# Altium schematic sheet 2040Macro-PCB.SchDoc
size A; SheetNumber: 3; SheetTotal: 9
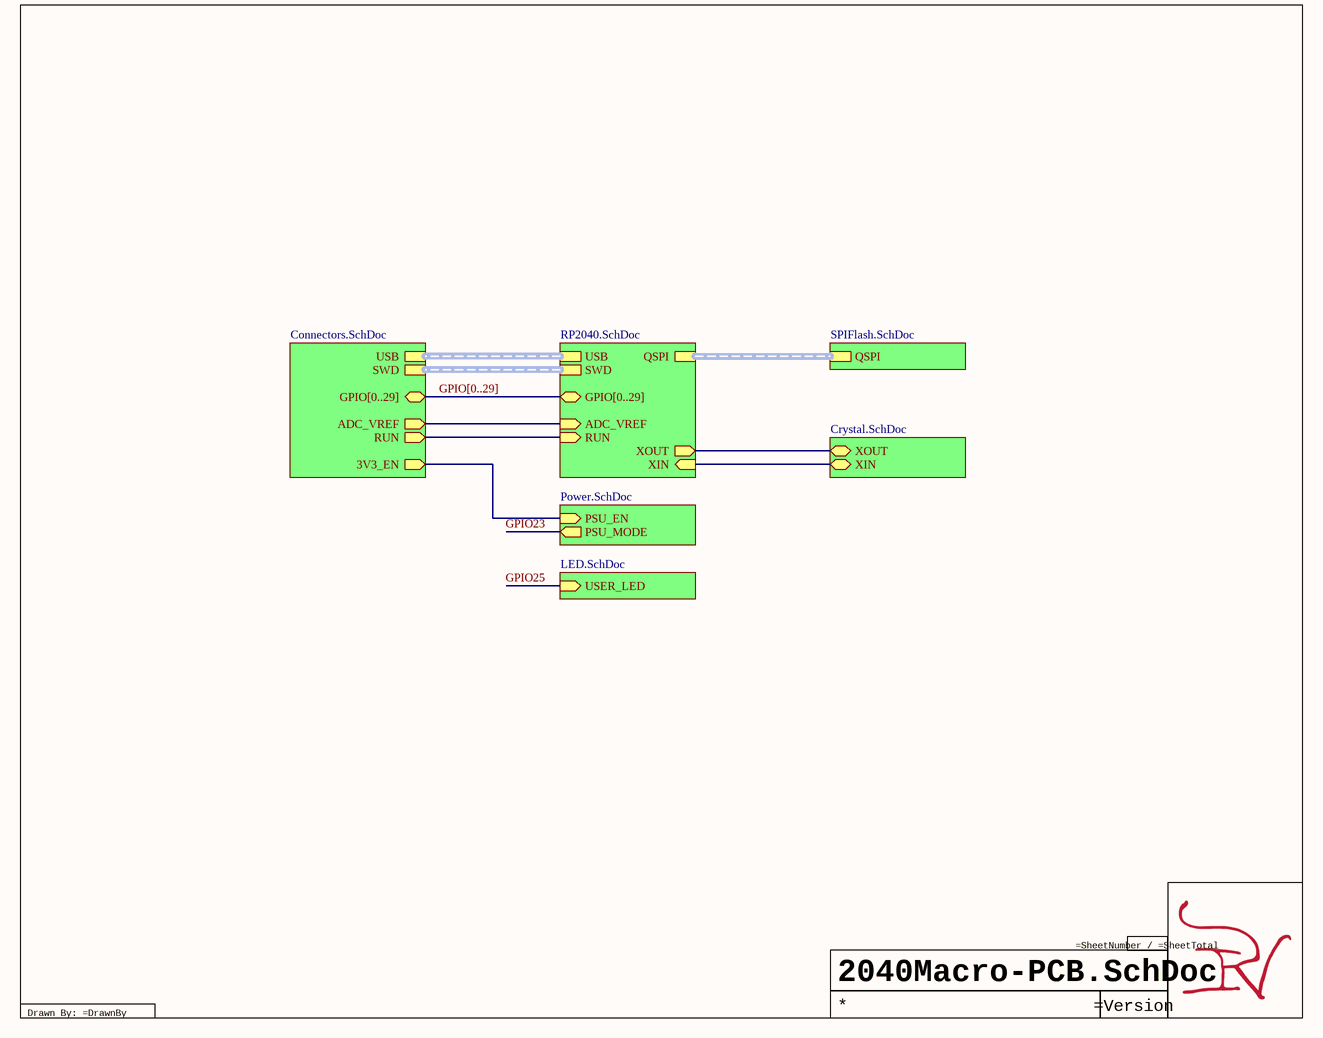
[diagram p0: 2040Macro-PCB.SchDoc]

## Sub-sheets
U_Connectors = Connectors.SchDoc: SWD (harness SWD), USB (harness USB 2.0), GPIO[0..29] (bidir), 3V3_EN (out), ADC_VREF (out), RUN (out)
U_Crystal = Crystal.SchDoc: XIN (bidir), XOUT (bidir)
U_LED = LED.SchDoc: USER_LED (in)
U_Power = Power.SchDoc: PSU_EN (in), PSU_MODE (out)
U_RP2040 = RP2040.SchDoc: GPIO[0..29] (bidir), USB (harness USB 2.0), XIN (in), XOUT (out), SWD (harness SWD), QSPI (harness QSPI), ADC_VREF (in), RUN (in)
U_SPIFlash = SPIFlash.SchDoc: QSPI (harness QSPI)

## Nets
GPIO23: sheet U_Power/PSU_MODE
GPIO25: sheet U_LED/USER_LED
(unnamed): sheet U_RP2040/XIN, sheet U_Crystal/XIN
(unnamed): sheet U_RP2040/XOUT, sheet U_Crystal/XOUT
(unnamed): sheet U_RP2040/ADC_VREF, sheet U_Connectors/ADC_VREF
(unnamed): sheet U_RP2040/RUN, sheet U_Connectors/RUN
(unnamed): sheet U_Power/PSU_EN, sheet U_Connectors/3V3_EN

## Buses and harness runs
bus GPIO[0..29] = sheet U_Connectors/GPIO[0..29] = sheet U_RP2040/GPIO[0..29]
harness sheet U_Connectors/SWD = sheet U_RP2040/SWD
harness sheet U_Connectors/USB = sheet U_RP2040/USB
harness sheet U_RP2040/QSPI = sheet U_SPIFlash/QSPI

## Notes on the sheet
- Drawn By: =DrawnBy